# EasyEDA Pro project 2dof-experiment-system.eprj, schematic Schematic2
Create Date: 2025-03-15; Page Name: P1; Project Name: 2dof-experiment-system; Schematic Name: Schematic2; Update Date: 2025-05-01; Company: 嘉立创EDA; Page Size: A3; Version: V1.0
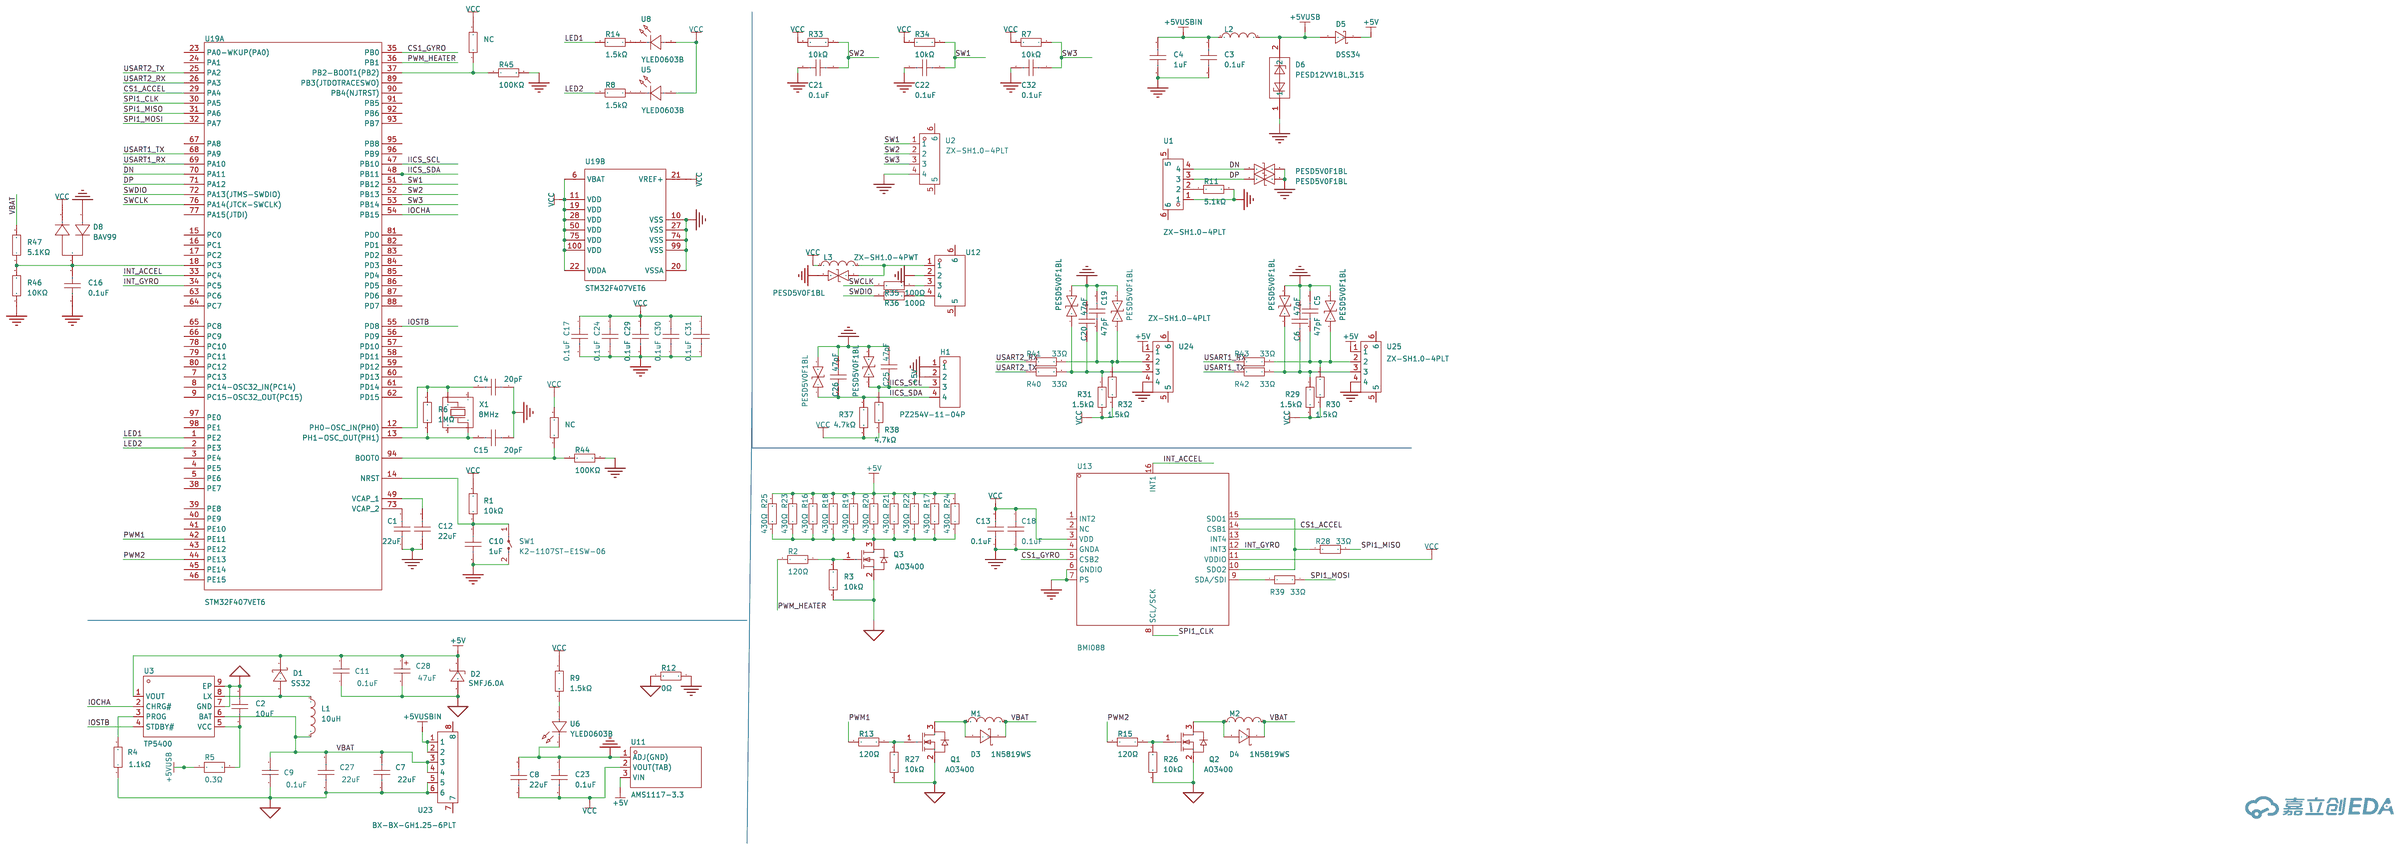
[diagram p1: schematic sheet]

## Parts
C1  22uF  [C1206]
C2  10uF  [C0603]
C3  0.1uF  [C0603]
C4  1uF  [C0603]
C5  47pF  [C0603]
C6  47pF  [C0603]
C7  22uF  [C1206]
C8  22uF  [C1206]
C9  0.1uF  [C0603]
C10  1uF  [C0603]
C11  0.1uF  [C0603]
C12  22uF  [C1206]
C13  0.1uF  [C0603]
C14  20pF  [C0603]
C15  20pF  [C0603]
C16  0.1uF  [C0603]
C17  0.1uF  [C0603]
C18  0.1uF  [C0603]
C19  47pF  [C0603]
C20  47pF  [C0603]
C21  0.1uF  [C0603]
C22  0.1uF  [C0603]
C23  0.1uF  [C0603]
C24  0.1uF  [C0603]
C25  47pF  [C0603]
C26  47pF  [C0603]
C27  22uF  [C1206]
C28  47uF  [CASE-B_3528]
C29  0.1uF  [C0603]
C30  0.1uF  [C0603]
C31  0.1uF  [C0603]
C32  0.1uF  [C0603]
D1  SS32  [SMA_L4.3-W2.6-LS5.2-RD]
D2  SMFJ6.0A  [SOD-123_L2.8-W1.8-LS3.7-RD]
D3  1N5819WS  [SOD-323_L1.8-W1.3-LS2.5-RD]
D4  1N5819WS  [SOD-323_L1.8-W1.3-LS2.5-RD]
D5  DSS34  [SOD-123FL_L2.7-W1.8-LS3.8-RD]
D6  PESD12VV1BL,315  [SOD-882_L1.0-W0.6-BI]
D8  BAV99  [SOT-23-3_L2.9-W1.3-P1.90-LS2.4-BR]
H1  PZ254V-11-04P  [HDR-TH_4P-P2.54-V-M]
L1  10uH  [IND-SMD_L7.3-W6.8]
L2  BLM18PG221SN1D  [L0603]
L3  BLM18PG221SN1D  [L0603]
M1  10uH  [L0603]
M2  10uH  [L0603]
NC  NC  [R0603]  (no BOM)
NC#2  NC  [R0603]  (no BOM)
Q1  AO3400  [SOT-23_L2.9-W1.3-P1.90-LS2.4-BR]
Q2  AO3400  [SOT-23_L2.9-W1.3-P1.90-LS2.4-BR]
Q3  AO3400  [SOT-23_L2.9-W1.3-P1.90-LS2.4-BR]
R1  10kΩ  [R0603]
R2  120Ω  [R0603]
R3  10kΩ  [R0603]
R4  1.1kΩ  [R0603]
R5  0.3Ω  [R1812]
R6  1MΩ  [R0603]
R7  10kΩ  [R0603]
R8  1.5kΩ  [R0603]
R9  1.5kΩ  [R0603]
R11  5.1kΩ  [R0603]
R12  0Ω  [R0603]
R13  120Ω  [R0603]
R14  1.5kΩ  [R0603]
R15  120Ω  [R0603]
R16  430Ω  [R0402]
R17  430Ω  [R0402]
R18  430Ω  [R0402]
R19  430Ω  [R0402]
R20  430Ω  [R0402]
R21  430Ω  [R0402]
R22  430Ω  [R0402]
R23  430Ω  [R0402]
R24  430Ω  [R0402]
R25  430Ω  [R0402]
R26  10kΩ  [R0603]
R27  10kΩ  [R0603]
R28  33Ω  [R0603]
R29  1.5kΩ  [R0603]
R30  1.5kΩ  [R0603]
R31  1.5kΩ  [R0603]
R32  1.5kΩ  [R0603]
R33  10kΩ  [R0603]
R34  10kΩ  [R0603]
R35  100Ω  [R0603]
R36  100Ω  [R0603]
R37  4.7kΩ  [R0603]
R38  4.7kΩ  [R0603]
R39  33Ω  [R0603]
R40  33Ω  [R0603]
R41  33Ω  [R0603]
R42  33Ω  [R0603]
R43  33Ω  [R0603]
R44  100KΩ  [R0603]
R45  100KΩ  [R0603]
R46  10KΩ  [R0603]
R47  5.1KΩ  [R0603]
SW1  K2-1107ST-E1SW-06  [SW-SMD_L6.0-W3.6-LS8.0]
U1  ZX-SH1.0-4PLT  [CONN-SMD_4P-P1.00_ZX-SH1.0-4PLN]
U2  ZX-SH1.0-4PLT  [CONN-SMD_4P-P1.00_ZX-SH1.0-4PLN]
U3  TP5400  [ESOP-8_L4.9-W3.9-P1.27-LS6.0-BL-EP]
U5  YLED0603B  [LED0603-RD]
U6  YLED0603B  [LED0603-RD]
U8  YLED0603B  [LED0603-RD]
U9  PESD5V0F1BL  [SOD-882_L1.0-W0.6-BI]
U10  PESD5V0F1BL  [SOD-882_L1.0-W0.6-BI]
U11  AMS1117-3.3  [SOT-89_L4.5-W2.5-P1.50-LS4.2-BR]
U12  ZX-SH1.0-4PWT  [CONN-SMD_4P-P1.00_MEGASTAR_ZX-SH1.0-4PWT]
U13  BMI088  [LGA-16_L4.5-W3.0-P0.50-BL]
U14  PESD5V0F1BL  [SOD-882_L1.0-W0.6-BI]
U15  PESD5V0F1BL  [SOD-882_L1.0-W0.6-BI]
U16  PESD5V0F1BL  [SOD-882_L1.0-W0.6-BI]
U17  PESD5V0F1BL  [SOD-882_L1.0-W0.6-BI]
U18  PESD5V0F1BL  [SOD-882_L1.0-W0.6-BI]
U19  STM32F407VET6  [LQFP-100_L14.0-W14.0-P0.50-LS16.0-BL]  (sections 1,2)
U20  PESD5V0F1BL  [SOD-882_L1.0-W0.6-BI]
U21  PESD5V0F1BL  [SOD-882_L1.0-W0.6-BI]
U23  BX-BX-GH1.25-6PLT  [CONN-SMD_6P-P1.25_BX-BX-GH1.25-6PLT]
U24  ZX-SH1.0-4PLT  [CONN-SMD_4P-P1.00_ZX-SH1.0-4PLN]
U25  ZX-SH1.0-4PLT  [CONN-SMD_4P-P1.00_ZX-SH1.0-4PLN]
X1  8MHz  [CRYSTAL-SMD_4P-L3.2-W2.5-BL]

## Library data of the parts
C1 C7 C8 C12 C27 = CGA1206X5R226M350NT: 容值:22uF;精度:±20%;额定电压:35V;材质(温度系数):X5R;; LCSC Part Name: 22uF ±20% 35V; Supplier Part: C6119969; Manufacturer: HRE(芯声); Supplier Footprint: 1206; JLCPCB Part Class: 扩展库; Supplier: LCSC; Tolerance: ±20%; Voltage Rated: 35V; Temperature Coefficient: X5R
C2-C6 C10 C13-C26 C29-C32 = CL10A226MQ8NRNC: 容值:22uF;精度:±20%;额定电压:6.3V;材质(温度系数):X5R;; LCSC Part Name: 22uF ±20% 6.3V; Supplier Part: C59461; Manufacturer: SAMSUNG(三星); Supplier Footprint: 0603; JLCPCB Part Class: 基础库; Datasheet: https://atta.szlcsc.com/upload/public/pdf/source/20160218/1457707763339.pdf; Supplier: LCSC; Tolerance: ±20%; Voltage Rated: 6.3V; Temperature Coefficient: X5R
C9 C11 = 0603B104K500NT: 容值:100nF;精度:±10%;额定电压:50V;材质(温度系数):X7R;; LCSC Part Name: 100nF ±10% 50V; Supplier Part: C30926; Manufacturer: FH(风华); Supplier Footprint: 0603; JLCPCB Part Class: 扩展库; Datasheet: https://atta.szlcsc.com/upload/public/pdf/source/20200305/C486355_26A10D38EF8C2A5C37091D0039909270.pdf; Supplier: LCSC; Tolerance: ±10%; Voltage Rated: 50V; Temperature Coefficient: X7R
C28 = TAJB476K010RNJ: 容值:47uF;精度:±10%;额定电压:10V;等效串联电阻:1Ω@100kHz;; LCSC Part Name: 47uF ±10% 10V; Supplier Part: C22036; Manufacturer: Kyocera AVX; Supplier Footprint: CASE-B-3528; JLCPCB Part Class: 扩展库; Datasheet: https://atta.szlcsc.com/upload/public/pdf/source/20160107/1457707750344.pdf; Supplier: LCSC; Tolerance: ±10%; Rated Voltage: 10V; Equivalent Series Resistance(ESR): 1Ω@100kHz; Operating Temperature: -55℃~+125℃
D1 = SS32_C34897: 二极管配置:-;正向压降(Vf):550mV@3A;直流反向耐压(Vr):20V;平均整流电流(Io):3A;; LCSC Part Name: 电压:20V 电流:3A; Supplier Part: C34897; Manufacturer: MDD; Supplier Footprint: SMA(DO-214AC); JLCPCB Part Class: 扩展库; Datasheet: https://atta.szlcsc.com/upload/public/pdf/source/20230314/A80AE34493C69B89E2F4B1712F433538.pdf; Supplier: LCSC; Forward Voltage (Vf@If): 550mV@3A; Reverse Voltage (Vr): 20V; Average Rectified Current (Io): 3A
D2 = SMFJ6.0A_C44898: 反向截止电压(Vrwm):6V;最大钳位电压:10.3V;峰值脉冲电流(Ipp)@10/1000us:19.4A;击穿电压:6.67V;; Supplier Part: C44898; Manufacturer: RUILON(瑞隆源); Supplier Footprint: SOD-123; JLCPCB Part Class: 扩展库; Datasheet: https://atta.szlcsc.com/upload/public/pdf/source/20170601/1496285789057.pdf; Supplier: LCSC; Reverse Stand-Off Voltage (Vrwm): 6V; Maximum Clamping Voltage: 10.3V; Peak Pulse Current (Ipp)@10/1000us: 19.4A; Breakdown Voltage: 6.67V; Type: TVS
D3 D4 = 1N5819WS_C191023: 正向压降(Vf):600mV@1A;直流反向耐压(Vr):40V;整流电流:1A;; LCSC Part Name: 电压:40V 电流:1A; Supplier Part: C191023; Manufacturer: Hottech(合科泰); Supplier Footprint: SOD-323; JLCPCB Part Class: 基础库; Datasheet: https://atta.szlcsc.com/upload/public/pdf/source/20220428/3CB86FD8D28D653594B4E35F9D5AEFD9.pdf; Supplier: LCSC; Forward Voltage (Vf@If): 600mV@1A; Reverse Voltage (Vr): 40V; Rectified Current: 1A
D5 = DSS34_C511866: 正向压降(Vf):550mV@3A;直流反向耐压(Vr):40V;整流电流:3A;; LCSC Part Name: 电压:40V 电流:3A; Supplier Part: C511866; Manufacturer: BORN(伯恩半导体); Supplier Footprint: SOD-123FL; JLCPCB Part Class: 扩展库; Datasheet: https://atta.szlcsc.com/upload/public/pdf/source/20231213/A35D7F17905BC063B6E854915CEDE7F7.pdf; Supplier: LCSC; Forward Voltage (Vf@If): 550mV@3A; Reverse Voltage (Vr): 40V; Rectified Current: 3A
D6 = PESD12VV1BL,315: 极性:双向;反向截止电压(Vrwm):12V;最大钳位电压:38V;峰值脉冲电流(Ipp):7.8A;峰值脉冲功率(Ppp):290W;击穿电压:14.6V;; LCSC Part Name: 双向ESD; Supplier Part: C111472; Manufacturer: Nexperia(安世); Supplier Footprint: DFN1006-2; JLCPCB Part Class: 扩展库; Datasheet: https://atta.szlcsc.com/upload/public/pdf/source/20240724/4CDB497F9DBD694C9A7C3A0FAC354E5B.pdf; Supplier: LCSC; polarity: 双向; Reverse Stand-Off Voltage (Vrwm): 12V; Maximum Clamping Voltage: 38V; Peak Pulse Current (Ipp): 7.8A; Peak Pulse Power Dissipation (Ppp): 290W; Breakdown Voltage: 14.6V; Number of Lines: 单路; Operating Temperature: -55℃~+150℃@(Ta); Type: ESD
D8 = BAV99_C7420336: 二极管配置:1对串联式;正向压降(Vf):1.25V@150mA;直流反向耐压(Vr):70V;整流电流:200mA;反向恢复时间(Trr):4ns;; Supplier Part: C7420336; Manufacturer: 宏嘉诚; Supplier Footprint: SOT-23; JLCPCB Part Class: 扩展库; Datasheet: https://atta.szlcsc.com/upload/public/pdf/source/20250116/6AABCE46370D1EDA81E0131424A55175.pdf; Supplier: LCSC; Diode Configuration: 1对串联式; Voltage - Forward(Vf@If): 1.25V@150mA; Voltage - DC Reverse(Vr): 70V; Current - Rectified: 200mA; Reverse Leakage Current (Ir): 2.5uA@75V; Reverse Recovery Time (trr): 4ns; Operating Temperature: -55℃~+150℃
H1 = PZ254V-11-04P: 插针结构:1x4P;间距:2.54mm;行距:-;圆针/方针:方针;安装类型:直插;排数:单排;总PIN位数:4P;额定电流:3A;额定电压:250V;配合针长度:6mm;塑高:2.5mm;端接针长度:3mm;触头材质:-;工作温度范围:-40℃~+105℃;颜色:黑色;; LCSC Part Name: 间距:2.54mm 1x4P 直插 方针; Supplier Part: C2691448; Manufacturer: XFCN(兴飞); Supplier Footprint: 插件,P=2.54mm; JLCPCB Part Class: 扩展库; Datasheet: https://atta.szlcsc.com/upload/public/pdf/source/20200309/C492403_F9F19131791D08044AD4F84F8E751A34.pdf; Supplier: LCSC; Pin Structure: 1x4P; Pitch: 2.54mm; Circluar Pins/Square Pins: 方针; Mounting Type: 直插; Number of Rows: 单排; Number of Pins: 4P; Current Rating (Max): 3A; Voltage Rating (Max): 250V; Length of Mating Pin: 6mm; Insulation Height: 2.5mm; Length of End Connection Pin: 3mm; Operating Temperature Range: -40℃~+105℃; Color: 黑色
L1 = FXL0630-100-M: 电感值:10uH;精度:±20%;额定电流:4.5A;饱和电流(Isat):5.5A;类型:一体成型电感;; LCSC Part Name: 10uH ±20% 5.5A; Supplier Part: C167223; Manufacturer: cjiang(长江微电); Supplier Footprint: SMD,6.6x7mm; JLCPCB Part Class: 扩展库; Datasheet: https://atta.szlcsc.com/upload/public/pdf/source/20230516/3A080F5AF8C87BB81C3BA86E5F60E51A.pdf; Supplier: LCSC; Tolerance: ±20%; Rated Current: 4.5A; Saturation Current (Isat): 5.5A; DC Resistance (DCR): 68mΩ; Type: 一体成型电感
L2 L3 = BLM18PG221SN1D: 标称阻抗@测试频率:220Ω@100MHz;误差:±25%;直流电阻(RDC):100mΩ;; LCSC Part Name: 单路 0603磁珠 阻抗220Ω@100MHz; Supplier Part: C80165; Manufacturer: muRata(村田); Supplier Footprint: 0603; JLCPCB Part Class: 扩展库; Datasheet: https://atta.szlcsc.com/upload/public/pdf/source/20191226/C476007_90F4628D6A1A8703036BE981B9833918.pdf; Supplier: LCSC; Impedance @ Frequency: 220Ω@100MHz; Tolerance: ±25%; DC Resistance: 100mΩ; Current Rating: 1.4A; Circuits: 1
M1 M2 = L_0603
NC NC#2 R1-R4 R6-R9 R11-R15 R26-R47 = RC0603FR-071KL: 电阻类型:厚膜电阻;阻值:1kΩ;精度:±1%;功率:100mW;最大工作电压:75V;温度系数:±100ppm/℃;; LCSC Part Name: 厚膜电阻 1kΩ ±1% 100mW; Supplier Part: C22548; Manufacturer: YAGEO(国巨); Supplier Footprint: 0603; JLCPCB Part Class: 扩展库; Datasheet: https://atta.szlcsc.com/upload/public/pdf/source/20180316/70C0E2BDAE7FCC62C531A5A58D202EE1.pdf; Supplier: LCSC; Type: 厚膜电阻; Tolerance: ±1%; Power(Watts): 100mW; Overload Voltage (Max): 75V; Temperature Coefficient: ±100ppm/℃; Operating Temperature Range: -55℃~+155℃
Q1-Q3 = AO3400_C2938367: 类型:1个N沟道;漏源电压(Vdss):30V;连续漏极电流(Id):5.8A;导通电阻(RDS(on)@Vgs,Id):52mΩ@2.5V,4A;功率(Pd):1.5W;阈值电压(Vgs(th)@Id):700mV@250uA;; LCSC Part Name: N沟道增强模式场效应晶体管,电流:5.8A,耐压:30V; Supplier Part: C2938367; Manufacturer: GOODWORK(固得沃克); Supplier Footprint: SOT-23; Datasheet: https://atta.szlcsc.com/upload/public/pdf/source/20240805/AF56525E67E43DBB802F95DDDF058BE9.pdf; Supplier: LCSC; Type: 1个N沟道; Drain Source Voltage (Vdss): 30V; Continuous Drain Current (Id): 5.8A; Drain Source On Resistance (RDS(on)@Vgs,Id): 52mΩ@2.5V,4A; Power Dissipation (Pd): 1.5W; Gate Threshold Voltage (Vgs(th)@Id): 700mV@250uA; Input Capacitance (Ciss@Vds): 1.05nF; Reverse Transfer Capacitance (Crss@Vds): 77pF; Operating Temperature: -55℃~+150℃
R5 = FRC1812F1004TS: 电阻类型:厚膜电阻;阻值:1MΩ;精度:±1%;功率:750mW;最大工作电压:200V;温度系数:±100ppm/℃;; LCSC Part Name: 1MΩ ±1% 750mW 厚膜电阻; Supplier Part: C2933874; Manufacturer: FOJAN(富捷); Supplier Footprint: 1812; JLCPCB Part Class: 扩展库; Datasheet: https://atta.szlcsc.com/upload/public/pdf/source/20211221/925EC7D7225764EE0046F22065062C87.pdf; Supplier: LCSC; Type: 厚膜电阻; Tolerance: ±1%; Power(Watts): 750mW; Overload Voltage (Max): 200V; Temperature Coefficient: ±100ppm/℃; Operating Temperature Range: -55℃~+155℃
R16-R25 = RC0402FR-07430RL: 电阻类型:厚膜电阻;阻值:430Ω;精度:±1%;功率:62.5mW;最大工作电压:50V;温度系数:±100ppm/℃;; LCSC Part Name: 厚膜电阻 430Ω ±1% 62.5mW; Supplier Part: C163462; Manufacturer: YAGEO(国巨); Supplier Footprint: 0402; JLCPCB Part Class: 扩展库; Datasheet: https://atta.szlcsc.com/upload/public/pdf/source/20181009/C309620_DA5935B6E1D48212CB7A533FE518B3C2.pdf; Supplier: LCSC; Type: 厚膜电阻; Tolerance: ±1%; Power(Watts): 62.5mW; Overload Voltage (Max): 50V; Temperature Coefficient: ±100ppm/℃; Operating Temperature Range: -55℃~+155℃
SW1 = K2-1107ST-E1SW-06: 作用力:90gf;安装方式:立贴;开关长度:6.1mm;开关宽度:3.6mm;开关高度:2.5mm;触点电流:50mA;额定电压(DC):12V;绝缘电阻:100MΩ;机械寿命:10万次;; LCSC Part Name: 362.5 进口弹片 有防水膜 灰胶头100G; Supplier Part: C707329; Manufacturer: 韩国韩荣; Supplier Footprint: SMD; JLCPCB Part Class: 扩展库; Datasheet: https://atta.szlcsc.com/upload/public/pdf/source/20210810/381712CEF248770C072B585C3485C888.pdf; Supplier: LCSC; Operating Force: 90gf; Mounting Style: 立贴; Switch Length: 6.1mm; Switch Width: 3.6mm; Switch Height: 2.5mm; Contact Current: 50mA; Voltage Rating (DC): 12V; Insulation Resistance: 100MΩ; Mechanical Life: 10万次; Operating Temperature: -25℃~+85℃
U1 U2 U24 U25 = ZX-SH1.0-4PLT: 插针结构:1x4P;间距:1mm;安装方式:立贴;参考系列:SH;总PIN数:4P;排数:1;每排PIN数:4;行距:-;额定电流:-;触头材质:黄铜;触头镀层:锡;工作温度范围:-;; LCSC Part Name: 1x4P 间距:1mm 立贴 系列:SH; Supplier Part: C7430453; Manufacturer: Megastar(兆星); Supplier Footprint: SMD,P=1mm; JLCPCB Part Class: 扩展库; Datasheet: https://atta.szlcsc.com/upload/public/pdf/source/20230619/835F7171C111E992D22DF3E9A54627DE.pdf; Supplier: LCSC; Pins Structure: 1x4P; Pitch: 1mm; Mounting Style: 立贴; Reference Series: SH; Number of Pins: 4P; Number of Rows: 1; Number of PINs Per Row: 4; Contact Material: 黄铜; Contact Plating: 锡; Supplementary Features: 辅助焊脚; Colour: 米色; Z-Height of the Board: 4.4mm; X-Length of Bottom Edge on Board (Spacing Line): 6.35mm; Y-Width of Bottom Edge on Board: 3.74mm
U3 = TP5400: Supplier Part: C2891434; Manufacturer: TOPPOWER(南京拓微); Supplier Footprint: ESOP-8; JLCPCB Part Class: 扩展库; Datasheet: https://atta.szlcsc.com/upload/public/pdf/source/20210909/352D9D40D77A1DD73F7904E364EF004B.pdf; Supplier: LCSC
U5 U6 U8 = YLED0603B: 发光颜色:蓝色;正向电压(VF):2.6V~3.2V;功率:-;正向电流:30mA;主波长:460nm~475nm;发光角度:120°;工作温度:-40℃~+85℃;; Supplier Part: C19171394; Manufacturer: YONGYUTAI(永裕泰); Supplier Footprint: 0603; JLCPCB Part Class: 扩展库; Datasheet: https://atta.szlcsc.com/upload/public/pdf/source/20231027/6134FF4BA718E32A802654BBC76F69A6.pdf; Supplier: LCSC; Emitted Color: 蓝色; Forward Voltage (VF): 2.6V~3.2V; Forward Current: 30mA; Dominant Wavelength: 460nm~475nm; Viewing Angle: 120°; Operating Temperature: -40℃~+85℃
U9 U10 U14-U18 U20 U21 = PESD5V0F1BL_C3001950: Supplier Part: C3001950; Manufacturer: UMW(友台半导体); Supplier Footprint: SOD-882; JLCPCB Part Class: 扩展库; Datasheet: https://atta.szlcsc.com/upload/public/pdf/source/20231109/D135B9E130F972E457EE5E0D2011A286.pdf; Supplier: LCSC; Type: ESD
U11 = AMS1117-3.3_C347256: 输出类型:固定;工作电压:18V;输出电压:3.3V;输出电流:1A;电源纹波抑制比(PSRR):60dB@(120Hz);输出极性:正极;; LCSC Part Name: 输出:3.3V 电流:1A 耐压:12V; Supplier Part: C347256; Manufacturer: UMW(友台半导体); Supplier Footprint: SOT-89; Datasheet: https://atta.szlcsc.com/upload/public/pdf/source/20241218/BAF0263FA2E44BCD8AF41AA4FA04EFAA.pdf; Supplier: LCSC; Output Type: 固定; Maximum Input Voltage: 18V; Output Voltage: 3.3V; Output Current: 1A; Power Supply Rejection Ratio (PSRR): 60dB@(120Hz); Dropout Voltage: 1.3V@(1A); Feature: 过流保护(OCP); Output Polarity: 正极; Number of Outputs: 1
U12 = ZX-SH1.0-4PWT: 插针结构:1x4P;间距:1mm;安装方式:卧贴;参考系列:SH;总PIN数:4P;排数:1;每排PIN数:4;行距:-;额定电流:1A;触头材质:黄铜;触头镀层:锡;工作温度范围:-25℃~+85℃;; LCSC Part Name: 配套胶壳型号：ZX-SH1.0-4PJK 配套端子型号：ZX-SH1.0-DZ 配套杜邦线型号：ZX-SH1.0-4PBXC; Supplier Part: C7430446; Manufacturer: Megastar(兆星); Supplier Footprint: SMD,P=1mm,卧贴; JLCPCB Part Class: 扩展库; Datasheet: https://atta.szlcsc.com/upload/public/pdf/source/20230619/390816C24B7A0EB1D042395C380CEA99.pdf; Supplier: LCSC; Pins Structure: 1x4P; Pitch: 1mm; Mounting Style: 卧贴; Reference Series: SH; Number of Pins: 4P; Number of Rows: 1; Number of PINs Per Row: 4; Current Rating (Max): 1A; Contact Material: 黄铜; Contact Plating: 锡; Operating Temperature Range: -25℃~+85℃
U13 = BMI088: 传感器类型:加速度计陀螺仪;; Supplier Part: C194919; Manufacturer: Bosch(博世); Supplier Footprint: LGA-16(3x4.5); JLCPCB Part Class: 扩展库; Datasheet: https://atta.szlcsc.com/upload/public/pdf/source/20180628/C194919_66CCF125FF968C218A4D358C68AC68D6.pdf; Supplier: LCSC; Sensor Type: 加速度计陀螺仪; Operating Temperature: -40℃~+85℃
U19 = STM32F407VET6: CPU内核:ARM-M4;CPU最大主频:168MHz;应用领域:-;; LCSC Part Name: 带DSP和FPU的高性能基础系列ARM Cortex-M4 MCU，具有512 KB Flash、168 MHz CPU、ART加速器、以太网和FSMC; Supplier Part: C28730; Manufacturer: ST(意法半导体); Supplier Footprint: LQFP-100(14x14); JLCPCB Part Class: 扩展库; Datasheet: https://atta.szlcsc.com/upload/public/pdf/source/20140801/1457707197138.pdf; Supplier: LCSC; CPU Core: ARM-M4; CPU Maximum Speed: 168MHz; Program Storage Size: 512KB; Program Memory Type: FLASH; Number of I/O: 82; ADC (Bit): 12bit; DAC (Bit): 12bit; Low Voltage Detection Threshold: 1.8V~3.6V
U23 = BX-BX-GH1.25-6PLT: 插针结构:1x6P;间距:1.25mm;安装方式:立贴;参考系列:GH;总PIN数:6P;排数:1;每排PIN数:6;行距:-;额定电流:1A;触头材质:磷铜;触头镀层:锡;工作温度:-25℃~+85℃;; LCSC Part Name: 1x6P 间距:1.25mm 立贴 系列:GH; Supplier Part: C18077713; Manufacturer: Bossie(博锡); Supplier Footprint: SMD,P=1.25mm; JLCPCB Part Class: 扩展库; Datasheet: https://atta.szlcsc.com/upload/public/pdf/source/20231017/FDF03D906124BCFAE215564859754BC2.pdf; Supplier: LCSC; Pins Structure: 1x6P; Pitch: 1.25mm; Mounting Type: 立贴; Reference Series: GH; Number of Pins: 6P; Number of Rows: 1; Number of PINs Per Row: 6; Current Rating: 1A; Contact Material: 磷铜; Contact Plating: 锡; Operating Temperature: -25℃~+85℃; Voltage Rating: 125V; Plastic Material: LCP; Supplementary Features: 辅助焊脚; Color: 米色; Z-Height of the Board: 4.2mm; X-Length of Bottom Edge on Board (Spacing Line): 10.75mm; Y-Width of Bottom Edge on Board: 4.95mm
X1 = TAXM8M4RDBCCT2T: 晶振类型:贴片晶振;频率:8MHz;常温频差:±10ppm;负载电容:10pF;频率稳定度(全温):±15ppm;; LCSC Part Name: 8MHz ±10ppm 10pF; Supplier Part: C400090; Manufacturer: YJX(雅晶鑫); Supplier Footprint: SMD3225-4P; JLCPCB Part Class: Extended Part; Datasheet: https://atta.szlcsc.com/upload/public/pdf/source/20190626/C400090_CF95B89E745AFE4EF2E392EF8AC009D6.pdf; Supplier: LCSC; Crystal Type: 贴片晶振; Normal temperature Frequency Tolerance: ±10ppm; Load Capacitor: 10pF; Frequency Stability(Full temperature range): ±15ppm; Equivalent Series Resistance (ESR): 250Ω; Operating Temperature: -40℃~+85℃

## Nets
+5V: C11.2 C28.1 D1.1(K) D2.1(K) D5.1 H1.2 R16.2 R17.2 R18.2 R19.2 R20.2 R21.2 R22.2 R23.2 R24.2 R25.2 U3.1(VOUT) U11.3(VIN) U24.1 U25.1
+5VUSB: D5.2 D6.2 L2.2 R5.1
+5VUSBIN: C3.1 C4.1 L2.1 U23.1 U23.2
AGND: C2.2 C7.1 C9.1 C11.1 C27.1 C28.2 D2.2(A) Q1.2(S) Q2.2(S) Q3.2(S) R3.2 R4.1 R12.2 R26.2 R27.2 U3.7(GND) U3.9(EP) U23.5 U23.6
GND: C1.1 C3.2 C4.2 C5.1 C6.1 C8.2 C10.2 C12.1 C13.1 C14.1 C15.1 C16.2 C17.2 C18.1 C19.1 C20.1 C21.2 C22.2 C23.1 C24.2 C25.1 C26.1 C29.2 C30.2 C31.2 C32.2 D6.1 D8.1 H1.1 R11.2 R12.1 R44.2 R45.2 R46.1 SW1.2 U1.1 U2.4 U6.1(K) U9.2 U10.2 U11.1(ADJ(GND)) U12.2 U13.4(GNDA) U13.6(GNDIO) U13.7(PS) U14.2 U15.2 U16.2 U17.2 U18.2 U19.10(VSS) U19.20(VSSA) U19.27(VSS) U19.74(VSS) U19.99(VSS) U20.1 U21.1 U24.4 U25.4
VBAT: C7.2 C9.2 C27.2 D3.1(K) D4.1(K) L1.2 M1.2 M2.2 R47.2 U3.6(BAT) U23.3 U23.4
VCC: C8.1 C13.2 C17.1 C18.2 C23.2 C24.1 C29.1 C30.1 C31.1 D8.2 L3.1 NC.2 NC#2.2 R1.2 R7.2 R9.1 R29.2 R30.2 R31.2 R32.2 R33.2 R34.2 R37.2 R38.2 U5.2(A) U8.2(A) U11.2(VOUT(TAB)) U13.3(VDD) U13.11(VDDIO) U19.6(VBAT) U19.11(VDD) U19.19(VDD) U19.21(VREF+) U19.22(VDDA) U19.28(VDD) U19.50(VDD) U19.75(VDD) U19.100(VDD)
CS1_ACCEL: U13.14(CSB1) U19.29(PA4)
CS1_GYRO: U13.5(CSB2) U19.35(PB0)
DN: U1.4 U19.70(PA11) U21.2
DP: U1.3 U19.71(PA12) U20.2
IICS_SCL: C25.2 H1.3 R38.1 U17.1 U19.47(PB10)
IICS_SDA: C26.2 H1.4 R37.1 U18.1 U19.48(PB11)
INT_ACCEL: U13.16(INT1) U19.33(PC4)
INT_GYRO: U13.12(INT3) U19.34(PC5)
IOCHA: U3.2(CHRG#) U19.54(PB15)
IOSTB: U3.4(STDBY#) U19.55(PD8)
LED1: R14.2 U19.1(PE2)
LED2: R8.2 U19.2(PE3)
PWM1: R13.2 U19.42(PE11)
PWM2: R15.2 U19.44(PE13)
PWM_HEATER: R2.2 U19.36(PB1)
SPI1_CLK: U13.8(SCL/SCK) U19.30(PA5)
SPI1_MISO: R28.2 U19.31(PA6)
SPI1_MOSI: R39.2 U19.32(PA7)
SW1: C22.1 R34.1 U2.1 U19.51(PB12)
SW2: C21.1 R33.1 U2.2 U19.52(PB13)
SW3: C32.1 R7.1 U2.3 U19.53(PB14)
SWCLK: R35.2 U19.76(PA14(JTCK-SWCLK))
SWDIO: R36.2 U19.72(PA13(JTMS-SWDIO))
USART1_RX: R43.1 U19.69(PA10)
USART1_TX: R42.1 U19.68(PA9)
USART2_RX: R41.1 U19.26(PA3)
USART2_TX: R40.1 U19.25(PA2)
$1N20372: R4.2 U3.3(PROG)
$1N20376: D1.2(A) L1.1 U3.8(LX)
$1N20428: L3.2 U12.1 U16.1
$1N20430: R35.1 U12.3
$1N20431: R36.1 U12.4
$1N20434: R9.2 U6.2(A)
$1N20465: Q2.1(G) R15.1 R26.1
$1N20470: C2.1 R5.2 U3.5(VCC)
$1N28925: R39.1 U13.9(SDA/SDI)
$1N32308: Q3.3(D) R16.1 R17.1 R18.1 R19.1 R20.1 R21.1 R22.1 R23.1 R24.1 R25.1
$1N33131: Q3.1(G) R2.1 R3.1
$1N46301: R28.1 U13.10(SDO2) U13.15(SDO1)
$1N57962: C19.2 R32.1 R41.2 U14.1 U24.2
$1N57963: C20.2 R31.1 R40.2 U15.1 U24.3
$1N67734: R14.1 U8.1(K)
$1N67735: R8.1 U5.1(K)
$1N70426: Q1.1(G) R13.1 R27.1
$1N102233: C5.2 R30.1 R43.2 U9.1 U25.2
$1N102234: C6.2 R29.1 R42.2 U10.1 U25.3
$1N134604: C1.2 U19.73(VCAP_2)
$1N134860: C12.2 U19.49(VCAP_1)
$1N137537: C14.2 R6.2 U19.12(PH0-OSC_IN(PH0)) X1.1
$1N137538: C15.2 R6.1 U19.13(PH1-OSC_OUT(PH1)) X1.3
$1N148453: C16.1 D8.3 R46.2 R47.1 U19.18(PC3)
$1N180282: R11.1 U1.2
Net-(C10-1): C10.1 R1.1 SW1.1 U19.14(NRST)
Net-(D3-2): D3.2(A) M1.1 Q1.3(D)
Net-(D4-2): D4.2(A) M2.1 Q2.3(D)
Net-(NC#2-1): NC#2.1 R45.1 U19.37(PB2-BOOT1(PB2))
Net-(NC-1): NC.1 R44.1 U19.94(BOOT0)

Not connected (* = marked no-connect by the designer): U1 5 6; U2 5 6; U12 5 6; U13 1(INT2) 2(NC) 13(INT4); U19 3(PE4) 4(PE5) 5(PE6) 7(PC13) 8(PC14-OSC32_IN(PC14)) 9(PC15-OSC32_OUT(PC15)) 15(PC0) 16(PC1) 17(PC2) 23(PA0-WKUP(PA0)) 24(PA1) 38(PE7) 39(PE8) 40(PE9) 41(PE10) 43(PE12) 45(PE14) 46(PE15) 56(PD9) 57(PD10) 58(PD11) 59(PD12) 60(PD13) 61(PD14) 62(PD15) 63(PC6) 64(PC7) 65(PC8) 66(PC9) 67(PA8) 77(PA15(JTDI)) 78(PC10) 79(PC11) 80(PC12) 81(PD0) 82(PD1) 83(PD2) 84(PD3) 85(PD4) 86(PD5) 87(PD6) 88(PD7) 89(PB3(JTDOTRACESWO)) 90(PB4(NJTRST)) 91(PB5) 92(PB6) 93(PB7) 95(PB8) 96(PB9) 97(PE0) 98(PE1); U23 7 8; U24 5 6; U25 5 6; X1 2 4
